# Altium project INARad.PrjPcb
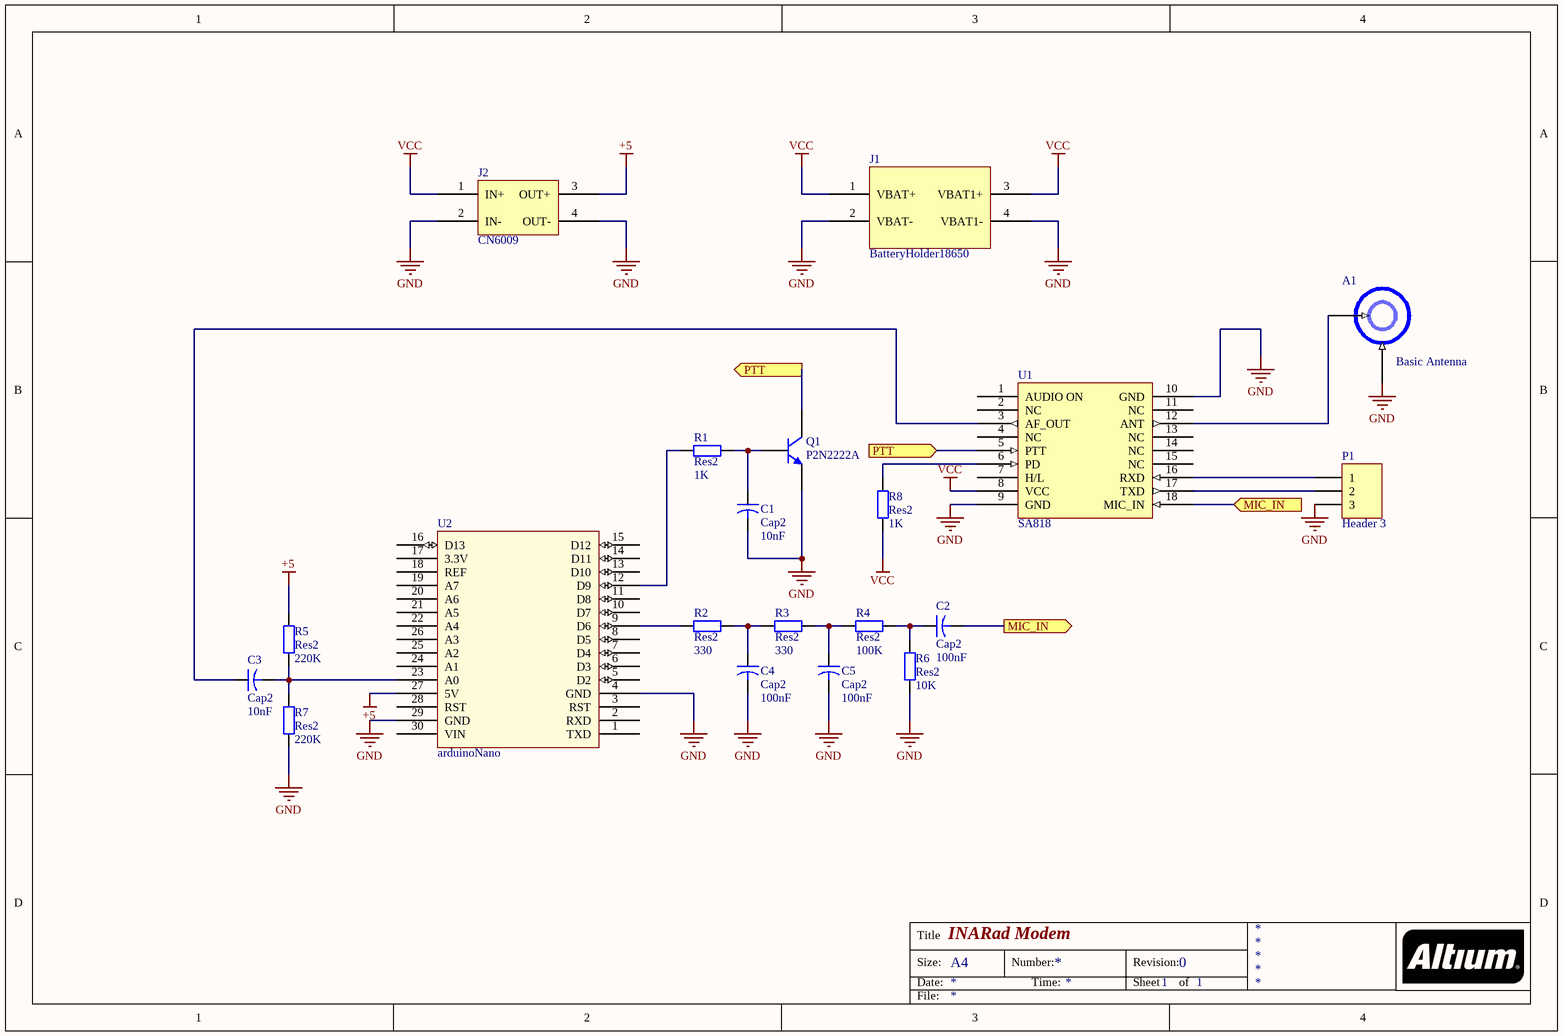
[diagram p0: Modem.SchDoc]
1 sheet, 20 parts. Net scope: flat (ports and power ports of the same name join across sheets).

## Sheet Modem.SchDoc: INARad Modem
size A4; DrawnBy: Josef Matondang; Engineer: Josef Matondang; Revision: 0; SheetNumber: 1; SheetTotal: 1

### Parts
A1  Basic Antenna  [CON-SMA-EDGE062]
C1  Cap2  value 10nF  [CAPR5-4X5]
C2  Cap2  value 100nF  [CAPR5-4X5]
C3  Cap2  value 10nF  [CAPR5-4X5]
C4  Cap2  value 100nF  [CAPR5-4X5]
C5  Cap2  value 100nF  [CAPR5-4X5]
J1  BatteryHolder18650  [BatteryHolder18650]
J2  CN6009  [CN6009]
P1  Header 3  [HDR1X3]
Q1  P2N2222A  [29-04]
R1  Res2  value 1K  [AXIAL-0.4]
R2  Res2  value 330  [AXIAL-0.4]
R3  Res2  value 330  [AXIAL-0.4]
R4  Res2  value 100K  [AXIAL-0.4]
R5  Res2  value 220K  [AXIAL-0.4]
R6  Res2  value 10K  [AXIAL-0.4]
R7  Res2  value 220K  [AXIAL-0.4]
R8  Res2  value 1K  [AXIAL-0.4]
U1  SA818  [SA818]
U2  arduinoNano  [Arduino nano]

### Ports
MIC_IN (in), MIC_IN (out), PTT (in), PTT (out)

### Nets
+5: J2.3(OUT+) R5.2 U2.27(5V)
GND: A1.G(Ground) C1.2 C4.2 C5.2 J1.2(VBAT-) J1.4(VBAT1-) J2.2(IN-) J2.4(OUT-) P1.3 Q1.3(E) R6.1 R7.1 U1.9(GND) U1.10(GND) U2.4(GND) U2.29(GND)
VCC: J1.1(VBAT+) J1.3(VBAT1+) J2.1(IN+) R8.1 U1.8(VCC)
NetA1_S: A1.S(Signal) U1.12(ANT)
NetC1_1: C1.1 Q1.2(B) R1.2
NetC2_1: C2.1 R4.2 R6.2
NetC2_2: C2.2 U1.18(MIC_IN) ; port MIC_IN
NetC3_1: C3.1 U1.3(AF_OUT)
NetC3_2: C3.2 R5.1 R7.2 U2.23(A0)
NetC4_1: C4.1 R2.2 R3.1
NetC5_1: C5.1 R3.2 R4.1
NetP1_1: P1.1 U1.16(RXD)
NetP1_2: P1.2 U1.17(TXD)
NetQ1_1: Q1.1(C) U1.5(PTT) ; port PTT
NetR1_1: R1.1 U2.12(D9)
NetR2_1: R2.1 U2.9(D6)
NetR8_2: R8.2 U1.6(PD)

Not connected (* = marked no-connect by the designer): U1 1(AUDIO_ON) 2(NC) 4(NC) 7(H/L) 11(NC) 13(NC) 14(NC) 15(NC); U2 1(TXD) 2(RXD) 3(RST) 5(D2) 6(D3) 7(D4) 8(D5) 10(D7) 11(D8) 13(D10) 14(D11) 15(D12) 16(D13) 17(3.3V) 18(REF) 19(A7) 20(A6) 21(A5) 22(A4) 24(A1) 25(A2) 26(A3) 28(RST) 30(VIN)

### Notes on the sheet
- Title
- Size:
- Date:
- A4
- Number:
- Time:
- Revision:
- Sheet
- of
- File:

### Library data of the parts
C1-C5 = Cap2: Capacitor; Published: 23-Sep-2002; PackageReference: CAPR5-4X5; Publisher: Altium Limited; PackageDescription: Capacitor; 2 Leads
P1 = Header 3: Header, 3-Pin; LatestRevisionDate: 17-Jul-2002; LatestRevisionNote: Re-released for DXP Platform.; Publisher: Altium Limited
Q1 = P2N2222A: Amplifier Transistor NPN Silicon; Published: 29-Sep-2000; LatestRevisionDate: 17-Jul-2002; LatestRevisionNote: Re-released for DXP Platform.; DatasheetVersion: 1996; PackageVersion: 1996; PackageReference: 29-04; Publisher: Altium Limited; PackageDescription: TO, Flat Index; 3 In-Line, Axial Leads; Body Dia. 4.8mm; Leads 0.48 x 0.5 mm (max); ComponentLink1Description: Manufacturer Link; ComponentLink1URL: http://www.onsemi.com/site/products/landing?taxonomyID=194; ComponentLink2Description: Datasheet; ComponentLink2URL: http://www.onsemi.com/pub/Collateral/P2N2222A-D.PDF
R1-R8 = Res2: Resistor; Published: 8-Jun-2000; LatestRevisionDate: 17-Jul-2002; LatestRevisionNote: Re-released for DXP Platform.; PackageReference: AXIAL-0.4; Publisher: Altium Limited; PackageDescription: Axial Device, Thru-Hole; 2 Leads; 0.4 in Pin Spacing